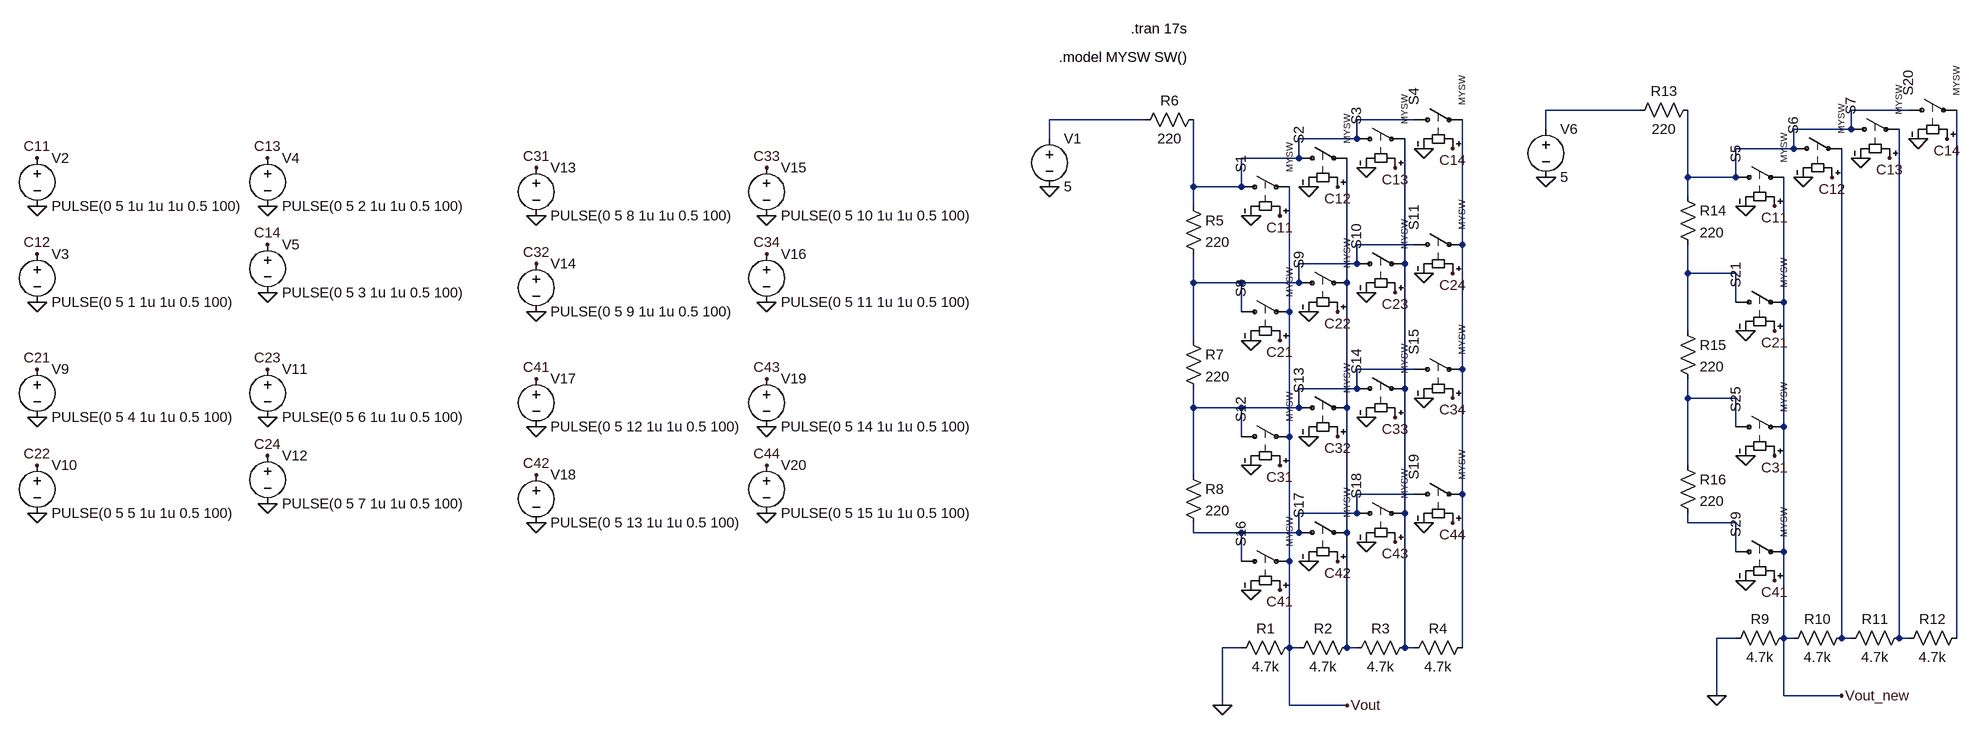
[diagram p0: schematic Matrix-Keyboard.asc]
Matrix-Keyboard.asc, the LTspice schematic file:
Version 4.1
SHEET 1 1416 964
WIRE 864 -128 704 -128
WIRE 1312 -128 1216 -128
WIRE -112 -112 -272 -112
WIRE 336 -112 240 -112
WIRE 704 -96 704 -128
WIRE 1216 -96 1216 -128
WIRE 1216 -96 1120 -96
WIRE -272 -80 -272 -112
WIRE 240 -80 240 -112
WIRE 240 -80 144 -80
WIRE 1120 -64 1120 -96
WIRE 1120 -64 1024 -64
WIRE 144 -48 144 -80
WIRE 144 -48 48 -48
WIRE 944 -16 944 -128
WIRE 1024 -16 1024 -64
WIRE 1024 -16 944 -16
WIRE -32 0 -32 -112
WIRE 48 0 48 -48
WIRE 48 0 -32 0
WIRE 944 16 944 -16
WIRE -32 32 -32 0
WIRE 336 96 240 96
WIRE 416 96 416 -112
WIRE 240 128 240 96
WIRE 240 128 144 128
WIRE 320 128 320 -80
WIRE 944 144 944 96
WIRE 1024 144 944 144
WIRE -32 160 -32 112
WIRE 48 160 -32 160
WIRE 144 160 144 128
WIRE 144 160 48 160
WIRE 224 160 224 -48
WIRE 1024 192 1024 144
WIRE 1104 192 1104 -16
WIRE 48 208 48 160
WIRE 128 208 128 0
WIRE 944 240 944 144
WIRE -32 256 -32 160
WIRE 336 304 240 304
WIRE 416 304 416 96
WIRE 240 336 240 304
WIRE 240 336 144 336
WIRE 320 336 320 128
WIRE 944 352 944 320
WIRE 1024 352 944 352
WIRE -32 368 -32 336
WIRE 48 368 -32 368
WIRE 144 368 144 336
WIRE 144 368 48 368
WIRE 224 368 224 160
WIRE 1024 400 1024 352
WIRE 1104 400 1104 192
WIRE 48 416 48 368
WIRE 128 416 128 208
WIRE 944 464 944 352
WIRE -32 480 -32 368
WIRE 336 512 240 512
WIRE 416 512 416 304
WIRE 240 544 240 512
WIRE 240 544 144 544
WIRE 320 544 320 336
WIRE 944 560 944 544
WIRE 1024 560 944 560
WIRE -32 576 -32 560
WIRE 48 576 -32 576
WIRE 144 576 144 544
WIRE 144 576 48 576
WIRE 224 576 224 368
WIRE 1024 608 1024 560
WIRE 1104 608 1104 400
WIRE 48 624 48 576
WIRE 128 624 128 416
WIRE 1024 752 992 752
WIRE 1104 752 1104 608
WIRE 1120 752 1104 752
WIRE 1200 752 1200 -64
WIRE 1216 752 1200 752
WIRE 1296 752 1296 -96
WIRE 1312 752 1296 752
WIRE 1392 752 1392 -128
WIRE 48 768 16 768
WIRE 128 768 128 624
WIRE 144 768 128 768
WIRE 224 768 224 576
WIRE 240 768 224 768
WIRE 320 768 320 544
WIRE 336 768 320 768
WIRE 416 768 416 512
WIRE 992 848 992 752
WIRE 1104 848 1104 752
WIRE 1200 848 1104 848
WIRE 16 864 16 768
WIRE 128 864 128 768
WIRE 224 864 128 864
FLAG 64 48 0
FLAG 160 0 0
FLAG 256 -32 0
FLAG 352 -64 0
FLAG 112 48 C11
FLAG -1968 -48 C11
FLAG 208 0 C12
FLAG -1968 112 C12
FLAG 304 -32 C13
FLAG -1584 -48 C13
FLAG 400 -64 C14
FLAG -1584 96 C14
FLAG -1968 32 0
FLAG -1968 192 0
FLAG -1584 32 0
FLAG -1584 176 0
FLAG 16 864 0
FLAG -272 0 0
FLAG 64 256 0
FLAG 160 208 0
FLAG 256 176 0
FLAG 352 144 0
FLAG 112 256 C21
FLAG 208 208 C22
FLAG 304 176 C23
FLAG 400 144 C24
FLAG 64 464 0
FLAG 160 416 0
FLAG 256 384 0
FLAG 352 352 0
FLAG 112 464 C31
FLAG 208 416 C32
FLAG 304 384 C33
FLAG 400 352 C34
FLAG 64 672 0
FLAG 160 624 0
FLAG 256 592 0
FLAG 352 560 0
FLAG 112 672 C41
FLAG 208 624 C42
FLAG 304 592 C43
FLAG 400 560 C44
FLAG 224 864 Vout
FLAG -1968 304 C21
FLAG -1968 464 C22
FLAG -1584 304 C23
FLAG -1584 448 C24
FLAG -1968 384 0
FLAG -1968 544 0
FLAG -1584 384 0
FLAG -1584 528 0
FLAG -1136 -32 C31
FLAG -1136 128 C32
FLAG -752 -32 C33
FLAG -752 112 C34
FLAG -1136 48 0
FLAG -1136 208 0
FLAG -752 48 0
FLAG -752 192 0
FLAG -1136 320 C41
FLAG -1136 480 C42
FLAG -752 320 C43
FLAG -752 464 C44
FLAG -1136 400 0
FLAG -1136 560 0
FLAG -752 400 0
FLAG -752 544 0
FLAG 1040 32 0
FLAG 1136 -16 0
FLAG 1232 -48 0
FLAG 1328 -80 0
FLAG 1088 32 C11
FLAG 1184 -16 C12
FLAG 1280 -48 C13
FLAG 1376 -80 C14
FLAG 992 848 0
FLAG 704 -16 0
FLAG 1040 240 0
FLAG 1088 240 C21
FLAG 1040 448 0
FLAG 1088 448 C31
FLAG 1040 656 0
FLAG 1088 656 C41
FLAG 1200 848 Vout_new
SYMBOL res 144 752 R90
WINDOW 0 0 56 VBottom 2
WINDOW 3 32 56 VTop 2
SYMATTR InstName R1
SYMATTR Value 4.7k
SYMBOL res 240 752 R90
WINDOW 0 0 56 VBottom 2
WINDOW 3 32 56 VTop 2
SYMATTR InstName R2
SYMATTR Value 4.7k
SYMBOL res 336 752 R90
WINDOW 0 0 56 VBottom 2
WINDOW 3 32 56 VTop 2
SYMATTR InstName R3
SYMATTR Value 4.7k
SYMBOL res 432 752 R90
WINDOW 0 0 56 VBottom 2
WINDOW 3 32 56 VTop 2
SYMATTR InstName R4
SYMATTR Value 4.7k
SYMBOL res -16 -128 R90
WINDOW 0 0 56 VBottom 2
WINDOW 3 32 56 VTop 2
SYMATTR InstName R6
SYMATTR Value 220
SYMBOL voltage -272 -96 R0
WINDOW 123 0 0 Left 0
WINDOW 39 0 0 Left 0
SYMATTR InstName V1
SYMATTR Value 5
SYMBOL sw 32 0 R270
WINDOW 3 24 96 Left 1
SYMATTR InstName S1
SYMATTR Value MYSW
SYMBOL sw 128 -48 R270
WINDOW 3 24 96 Left 1
SYMATTR InstName S2
SYMATTR Value MYSW
SYMBOL sw 224 -80 R270
WINDOW 3 24 96 Left 1
SYMATTR InstName S3
SYMATTR Value MYSW
SYMBOL sw 320 -112 R270
WINDOW 3 24 96 Left 1
SYMATTR InstName S4
SYMATTR Value MYSW
SYMBOL voltage -1968 -64 R0
WINDOW 123 0 0 Left 0
WINDOW 39 0 0 Left 0
SYMATTR InstName V2
SYMATTR Value PULSE(0 5 1u 1u 1u 0.5 100)
SYMBOL voltage -1968 96 R0
WINDOW 123 0 0 Left 0
WINDOW 39 0 0 Left 0
SYMATTR InstName V3
SYMATTR Value PULSE(0 5 1 1u 1u 0.5 100)
SYMBOL voltage -1584 -64 R0
WINDOW 123 0 0 Left 0
WINDOW 39 0 0 Left 0
SYMATTR InstName V4
SYMATTR Value PULSE(0 5 2 1u 1u 0.5 100)
SYMBOL voltage -1584 80 R0
WINDOW 123 0 0 Left 0
WINDOW 39 0 0 Left 0
SYMATTR InstName V5
SYMATTR Value PULSE(0 5 3 1u 1u 0.5 100)
SYMBOL res -48 16 R0
SYMATTR InstName R5
SYMATTR Value 220
SYMBOL res -48 240 R0
SYMATTR InstName R7
SYMATTR Value 220
SYMBOL res -48 464 R0
SYMATTR InstName R8
SYMATTR Value 220
SYMBOL sw 32 208 R270
WINDOW 3 24 96 Left 1
SYMATTR InstName S8
SYMATTR Value MYSW
SYMBOL sw 128 160 R270
WINDOW 3 24 96 Left 1
SYMATTR InstName S9
SYMATTR Value MYSW
SYMBOL sw 224 128 R270
WINDOW 3 24 96 Left 1
SYMATTR InstName S10
SYMATTR Value MYSW
SYMBOL sw 320 96 R270
WINDOW 3 24 96 Left 1
SYMATTR InstName S11
SYMATTR Value MYSW
SYMBOL sw 32 416 R270
WINDOW 3 24 96 Left 1
SYMATTR InstName S12
SYMATTR Value MYSW
SYMBOL sw 128 368 R270
WINDOW 3 24 96 Left 1
SYMATTR InstName S13
SYMATTR Value MYSW
SYMBOL sw 224 336 R270
WINDOW 3 24 96 Left 1
SYMATTR InstName S14
SYMATTR Value MYSW
SYMBOL sw 320 304 R270
WINDOW 3 24 96 Left 1
SYMATTR InstName S15
SYMATTR Value MYSW
SYMBOL sw 32 624 R270
WINDOW 3 24 96 Left 1
SYMATTR InstName S16
SYMATTR Value MYSW
SYMBOL sw 128 576 R270
WINDOW 3 24 96 Left 1
SYMATTR InstName S17
SYMATTR Value MYSW
SYMBOL sw 224 544 R270
WINDOW 3 24 96 Left 1
SYMATTR InstName S18
SYMATTR Value MYSW
SYMBOL sw 320 512 R270
WINDOW 3 24 96 Left 1
SYMATTR InstName S19
SYMATTR Value MYSW
SYMBOL voltage -1968 288 R0
WINDOW 123 0 0 Left 0
WINDOW 39 0 0 Left 0
SYMATTR InstName V9
SYMATTR Value PULSE(0 5 4 1u 1u 0.5 100)
SYMBOL voltage -1968 448 R0
WINDOW 123 0 0 Left 0
WINDOW 39 0 0 Left 0
SYMATTR InstName V10
SYMATTR Value PULSE(0 5 5 1u 1u 0.5 100)
SYMBOL voltage -1584 288 R0
WINDOW 123 0 0 Left 0
WINDOW 39 0 0 Left 0
SYMATTR InstName V11
SYMATTR Value PULSE(0 5 6 1u 1u 0.5 100)
SYMBOL voltage -1584 432 R0
WINDOW 123 0 0 Left 0
WINDOW 39 0 0 Left 0
SYMATTR InstName V12
SYMATTR Value PULSE(0 5 7 1u 1u 0.5 100)
SYMBOL voltage -1136 -48 R0
WINDOW 123 0 0 Left 0
WINDOW 39 0 0 Left 0
SYMATTR InstName V13
SYMATTR Value PULSE(0 5 8 1u 1u 0.5 100)
SYMBOL voltage -1136 112 R0
WINDOW 123 0 0 Left 0
WINDOW 39 0 0 Left 0
SYMATTR InstName V14
SYMATTR Value PULSE(0 5 9 1u 1u 0.5 100)
SYMBOL voltage -752 -48 R0
WINDOW 123 0 0 Left 0
WINDOW 39 0 0 Left 0
SYMATTR InstName V15
SYMATTR Value PULSE(0 5 10 1u 1u 0.5 100)
SYMBOL voltage -752 96 R0
WINDOW 123 0 0 Left 0
WINDOW 39 0 0 Left 0
SYMATTR InstName V16
SYMATTR Value PULSE(0 5 11 1u 1u 0.5 100)
SYMBOL voltage -1136 304 R0
WINDOW 123 0 0 Left 0
WINDOW 39 0 0 Left 0
SYMATTR InstName V17
SYMATTR Value PULSE(0 5 12 1u 1u 0.5 100)
SYMBOL voltage -1136 464 R0
WINDOW 123 0 0 Left 0
WINDOW 39 0 0 Left 0
SYMATTR InstName V18
SYMATTR Value PULSE(0 5 13 1u 1u 0.5 100)
SYMBOL voltage -752 304 R0
WINDOW 123 0 0 Left 0
WINDOW 39 0 0 Left 0
SYMATTR InstName V19
SYMATTR Value PULSE(0 5 14 1u 1u 0.5 100)
SYMBOL voltage -752 448 R0
WINDOW 123 0 0 Left 0
WINDOW 39 0 0 Left 0
SYMATTR InstName V20
SYMATTR Value PULSE(0 5 15 1u 1u 0.5 100)
SYMBOL res 1120 736 R90
WINDOW 0 0 56 VBottom 2
WINDOW 3 32 56 VTop 2
SYMATTR InstName R9
SYMATTR Value 4.7k
SYMBOL res 1216 736 R90
WINDOW 0 0 56 VBottom 2
WINDOW 3 32 56 VTop 2
SYMATTR InstName R10
SYMATTR Value 4.7k
SYMBOL res 1312 736 R90
WINDOW 0 0 56 VBottom 2
WINDOW 3 32 56 VTop 2
SYMATTR InstName R11
SYMATTR Value 4.7k
SYMBOL res 1408 736 R90
WINDOW 0 0 56 VBottom 2
WINDOW 3 32 56 VTop 2
SYMATTR InstName R12
SYMATTR Value 4.7k
SYMBOL res 960 -144 R90
WINDOW 0 0 56 VBottom 2
WINDOW 3 32 56 VTop 2
SYMATTR InstName R13
SYMATTR Value 220
SYMBOL voltage 704 -112 R0
WINDOW 123 0 0 Left 0
WINDOW 39 0 0 Left 0
SYMATTR InstName V6
SYMATTR Value 5
SYMBOL sw 1008 -16 R270
WINDOW 3 24 96 Left 1
SYMATTR InstName S5
SYMATTR Value MYSW
SYMBOL sw 1104 -64 R270
WINDOW 3 24 96 Left 1
SYMATTR InstName S6
SYMATTR Value MYSW
SYMBOL sw 1200 -96 R270
WINDOW 3 24 96 Left 1
SYMATTR InstName S7
SYMATTR Value MYSW
SYMBOL sw 1296 -128 R270
WINDOW 3 24 96 Left 1
SYMATTR InstName S20
SYMATTR Value MYSW
SYMBOL res 928 0 R0
SYMATTR InstName R14
SYMATTR Value 220
SYMBOL res 928 224 R0
SYMATTR InstName R15
SYMATTR Value 220
SYMBOL res 928 448 R0
SYMATTR InstName R16
SYMATTR Value 220
SYMBOL sw 1008 192 R270
WINDOW 3 24 96 Left 1
SYMATTR InstName S21
SYMATTR Value MYSW
SYMBOL sw 1008 400 R270
WINDOW 3 24 96 Left 1
SYMATTR InstName S25
SYMATTR Value MYSW
SYMBOL sw 1008 608 R270
WINDOW 3 24 96 Left 1
SYMATTR InstName S29
SYMATTR Value MYSW
TEXT -136 -264 Left 2 !.tran 17s
TEXT -256 -216 Left 2 !.model MYSW SW()

The netlist it stands for:
* Matrix-Keyboard.asc
R1 Vout 0 4.7k
R2 N009 Vout 4.7k
R3 N007 N009 4.7k
R4 N006 N007 4.7k
R6 N004 N003 220
V1 N003 0 5
S1 N004 Vout C11 0 MYSW
S2 N004 N009 C12 0 MYSW
S3 N004 N007 C13 0 MYSW
S4 N004 N006 C14 0 MYSW
V2 C11 0 PULSE(0 5 1u 1u 1u 0.5 100)
V3 C12 0 PULSE(0 5 1 1u 1u 0.5 100)
V4 C13 0 PULSE(0 5 2 1u 1u 0.5 100)
V5 C14 0 PULSE(0 5 3 1u 1u 0.5 100)
R5 N004 N005 220
R7 N005 N010 220
R8 N010 N012 220
S8 N005 Vout C21 0 MYSW
S9 N005 N009 C22 0 MYSW
S10 N005 N007 C23 0 MYSW
S11 N005 N006 C24 0 MYSW
S12 N010 Vout C31 0 MYSW
S13 N010 N009 C32 0 MYSW
S14 N010 N007 C33 0 MYSW
S15 N010 N006 C34 0 MYSW
S16 N012 Vout C41 0 MYSW
S17 N012 N009 C42 0 MYSW
S18 N012 N007 C43 0 MYSW
S19 N012 N006 C44 0 MYSW
V9 C21 0 PULSE(0 5 4 1u 1u 0.5 100)
V10 C22 0 PULSE(0 5 5 1u 1u 0.5 100)
V11 C23 0 PULSE(0 5 6 1u 1u 0.5 100)
V12 C24 0 PULSE(0 5 7 1u 1u 0.5 100)
V13 C31 0 PULSE(0 5 8 1u 1u 0.5 100)
V14 C32 0 PULSE(0 5 9 1u 1u 0.5 100)
V15 C33 0 PULSE(0 5 10 1u 1u 0.5 100)
V16 C34 0 PULSE(0 5 11 1u 1u 0.5 100)
V17 C41 0 PULSE(0 5 12 1u 1u 0.5 100)
V18 C42 0 PULSE(0 5 13 1u 1u 0.5 100)
V19 C43 0 PULSE(0 5 14 1u 1u 0.5 100)
V20 C44 0 PULSE(0 5 15 1u 1u 0.5 100)
R9 Vout_new 0 4.7k
R10 N014 Vout_new 4.7k
R11 N015 N014 4.7k
R12 N016 N015 4.7k
R13 N002 N001 220
V6 N001 0 5
S5 N002 Vout_new C11 0 MYSW
S6 N002 N014 C12 0 MYSW
S7 N002 N015 C13 0 MYSW
S20 N002 N016 C14 0 MYSW
R14 N002 N008 220
R15 N008 N011 220
R16 N011 N013 220
S21 N008 Vout_new C21 0 MYSW
S25 N011 Vout_new C31 0 MYSW
S29 N013 Vout_new C41 0 MYSW
.tran 17s
.model MYSW SW()
.backanno
.end

* Results of the author's LTspice run, read from the files saved beside the schematic
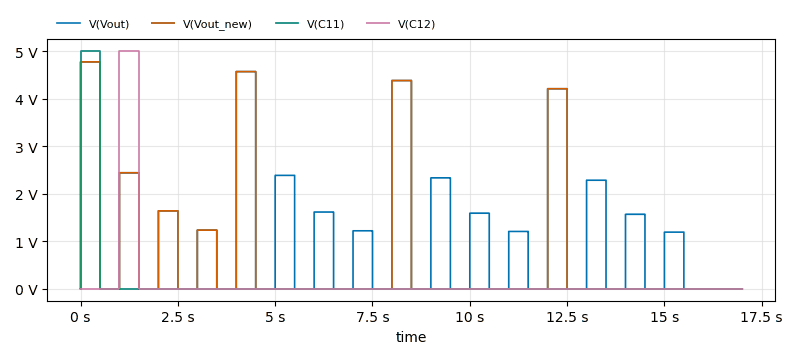
[diagram p1: Transient Analysis of Matrix-Keyboard.asc, plotted from the saved traces]
* Transient Analysis, 1 run:
*   V(Vout): min 752 nV, max 4.775 V, average 1.137 V, rms 1.872 V, last 752 nV
*   V(Vout_new): min 0 V, max 4.775 V, average 684.1 mV, rms 1.634 V, last 0 V
*   V(C11): min 0 V, max 5 V, average 147.1 mV, rms 857.5 mV, last 0 V
*   V(C12): min 0 V, max 5 V, average 147.1 mV, rms 857.5 mV, last 0 V